# EAGLE design meter (EAGLE 6.5.0)
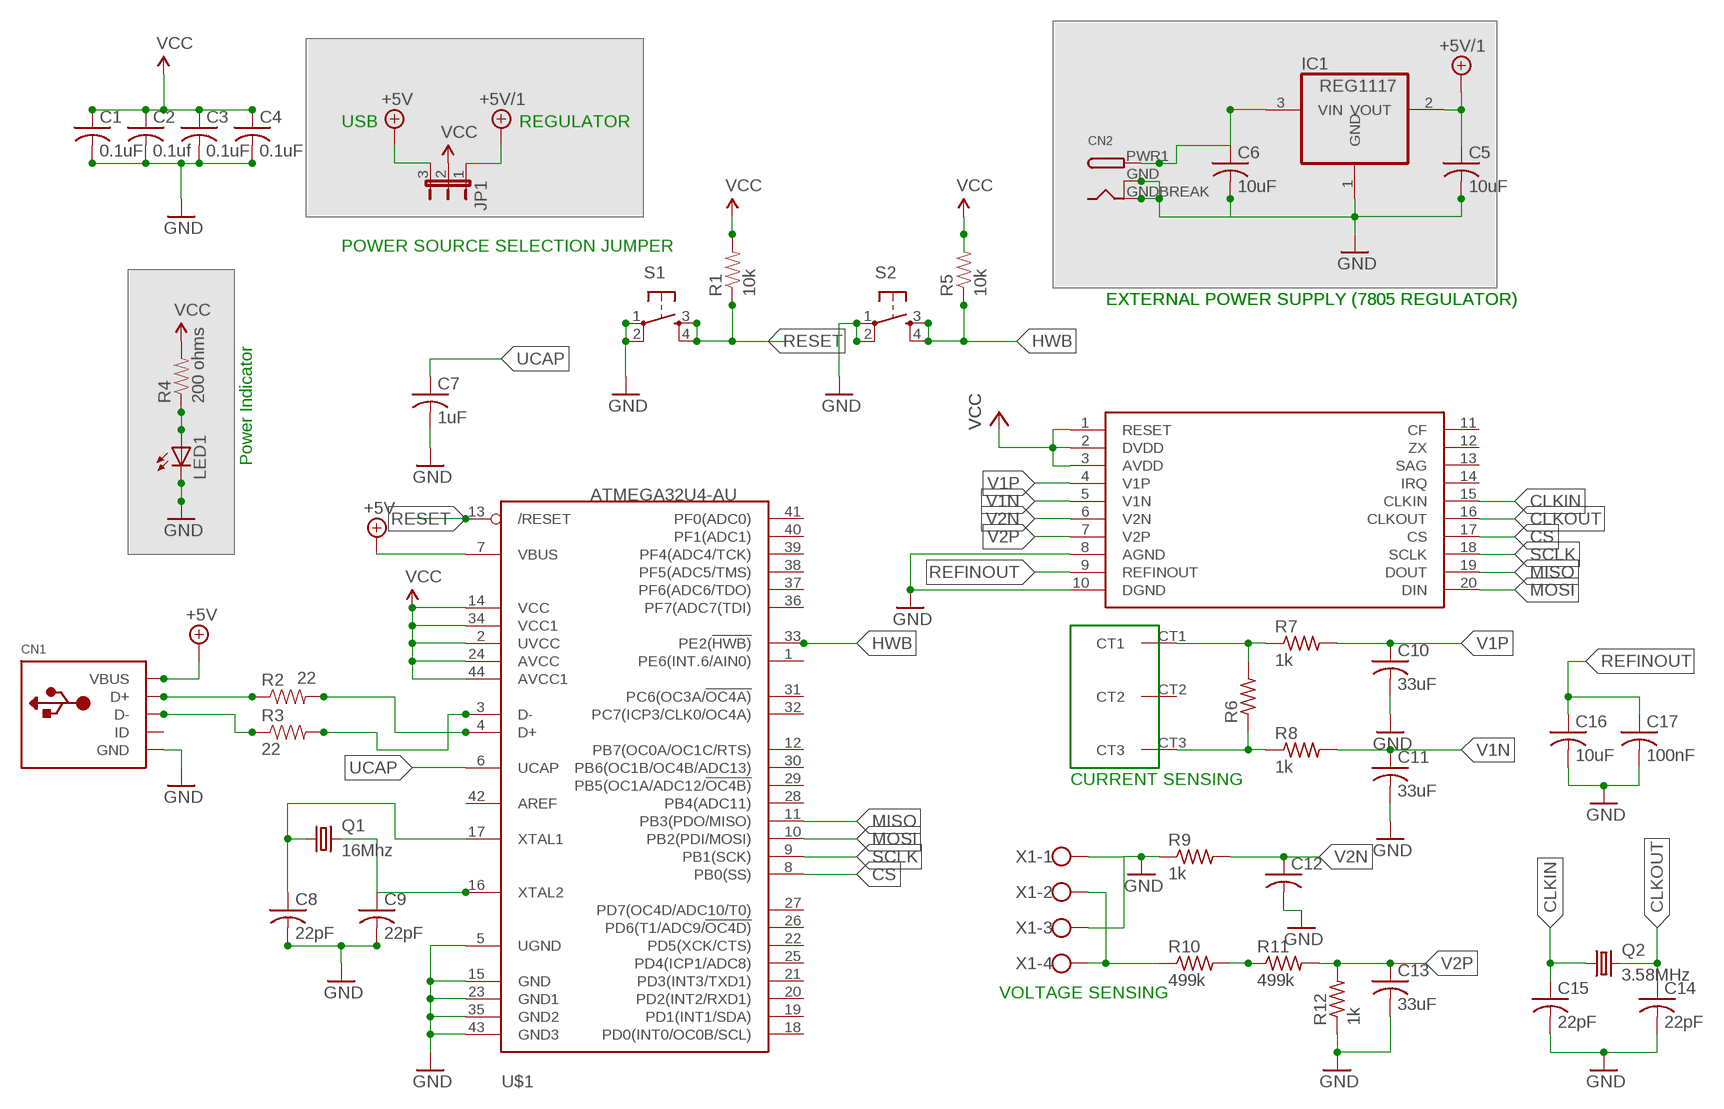
[diagram p0: schematic, sheet 1]

## Parts
C1  0.1uF  C-USC0603  [C0603]
C2  0.1uf  C-USC0603  [C0603]
C3  0.1uF  C-USC0603  [C0603]
C4  0.1uF  C-USC0603  [C0603]
C5  10uF  C-USC0603  [C0603]
C6  10uF  C-USC0603  [C0603]
C7  1uF  C-USC0603  [C0603]
C8  22pF  C-USC0603  [C0603]
C9  22pF  C-USC0603  [C0603]
C10  33uF  C-USC0603  [C0603]
C11  33uF  C-USC0603  [C0603]
C12  C-USC0603  [C0603]
C13  33uF  C-USC0603  [C0603]
C14  22pF  C-USC0603  [C0603]
C15  22pF  C-USC0603  [C0603]
C16  10uF  C-USC0603  [C0603]
C17  100nF  C-USC0603  [C0603]
CN1  USBMINIB  [USB-MINIB]
CN2  DCBARRELSMT  [DCJACK_2MM_SMT]
IC1  REG1117  [SOT223]
JP1  JP2E  [JP2]
LED1  LEDCHIP-LED0805  [CHIP-LED0805]
Q1  16Mhz  CSM-7X-DU  [CSM-7X-DU]
Q2  3.58MHz  CSM-7X-DU  [CSM-7X-DU]
R1  10k  RESISTOR0603-RES  [0603-RES]
R2  22  RESISTOR0603-RES  [0603-RES]
R3  22  RESISTOR0603-RES  [0603-RES]
R4  200 ohms  RESISTOR0603-RES  [0603-RES]
R5  10k  RESISTOR0603-RES  [0603-RES]
R6  R-US_R0603  [R0603]
R7  1k  R-US_R0603  [R0603]
R8  1k  R-US_R0603  [R0603]
R9  1k  R-US_R0603  [R0603]
R10  499k  R-US_R0603  [R0603]
R11  499k  R-US_R0603  [R0603]
R12  1k  R-US_R0603  [R0603]
S1  TAC_SWITCHSMD  [TACTILE_SWITCH_SMD]
S2  TAC_SWITCHSMD  [TACTILE_SWITCH_SMD]
U$1  ATMEGA32U4-AU  [TQFP44]
U$2  ADE7753  [SSOP20]
U$3  CT  [CT1075]
X1  W239-104  [W239-104]

## Nets
+5V: CN1.VBUS JP1.3 U$1.7(VBUS)
+5V/1: C5.1 IC1.2(VOUT) JP1.1
CLKIN: C15.1 Q2.1 U$2.15(CLKIN)
CLKOUT: C14.1 Q2.2 U$2.16(CLKOUT)
CS: U$1.8(PB0(SS)) U$2.17(CS)
GND: C1.2 C2.2 C3.2 C4.2 C5.2 C6.2 C7.2 C8.2 C9.2 C10.2 C11.2 C12.2 C13.2 C14.2 C15.2 C16.2 C17.2 CN1.GND CN2.GND(GNDBREAK) CN2.GNDBREAK(GND) IC1.1(GND) LED1.C R9.1 R12.1 S1.1 S1.2 S2.1 S2.2 U$1.5(UGND) U$1.15(GND) U$1.23(GND1) U$1.35(GND2) U$1.43(GND3) U$2.8(AGND) U$2.10(DGND) X1.1 X1.3
HWB: R5.1 S2.3 S2.4 U$1.33(PE2(!HWB))
MISO: U$1.11(PB3(PDO/MISO)) U$2.19(DOUT)
MOSI: U$1.10(PB2(PDI/MOSI)) U$2.20(DIN)
N$1: C8.1 Q1.1 U$1.17(XTAL1)
N$2: R10.2 R11.1
N$3: CN1.D+ R2.1
N$4: R2.2 U$1.4(D+)
N$5: CN1.D- R3.1
N$6: R3.2 U$1.3(D-)
N$7: LED1.A R4.1
N$8: C6.1 CN2.PWR1(PWR) IC1.3(VIN)
N$13: R6.2 R7.1 U$3.CT1
N$14: R6.1 R8.1 U$3.CT3
N$15: R10.1 X1.2 X1.4
N$17: C9.1 Q1.2 U$1.16(XTAL2)
REFINOUT: C16.1 C17.1 U$2.9(REFINOUT)
RESET: R1.1 S1.3 S1.4 U$1.13(/RESET)
SCLK: U$1.9(PB1(SCK)) U$2.18(SCLK)
UCAP: C7.1 U$1.6(UCAP)
V1N: C11.1 R8.2 U$2.5(V1N)
V1P: C10.1 R7.2 U$2.4(V1P)
V2N: C12.1 R9.2 U$2.6(V2N)
V2P: C13.1 R11.2 R12.2 U$2.7(V2P)
VCC: C1.1 C2.1 C3.1 C4.1 JP1.2 R1.2 R4.2 R5.2 U$1.2(UVCC) U$1.14(VCC) U$1.24(AVCC) U$1.34(VCC1) U$1.44(AVCC1) U$2.1(RESET) U$2.2(DVDD) U$2.3(AVDD)
Unconnected: CN1.ID U$1.1(PE6(INT.6/AIN0)) U$1.12(PB7(OC0A/OC1C/RTS)) U$1.18(PD0(INT0/OC0B/SCL)) U$1.19(PD1(INT1/SDA)) U$1.20(PD2(INT2/RXD1)) U$1.21(PD3(INT3/TXD1)) U$1.22(PD5(XCK/CTS)) U$1.25(PD4(ICP1/ADC8)) U$1.26(PD6(T1/ADC9/!OC4D)) U$1.27(PD7(OC4D/ADC10/T0)) U$1.28(PB4(ADC11)) U$1.29(PB5(OC1A/ADC12/!OC4B)) U$1.30(PB6(OC1B/OC4B/ADC13)) U$1.31(PC6(OC3A/!OC4A)) U$1.32(PC7(ICP3/CLK0/OC4A)) U$1.36(PF7(ADC7(TDI)) U$1.37(PF6(ADC6/TDO)) U$1.38(PF5(ADC5/TMS)) U$1.39(PF4(ADC4/TCK)) U$1.40(PF1(ADC1)) U$1.41(PF0(ADC0)) U$1.42(AREF) U$2.11(CF) U$2.12(ZX) U$2.13(SAG) U$2.14(IRQ) U$3.CT2

## Notes on the sheet
- USB | REGULATOR
- POWER SOURCE SELECTION JUMPER
- EXTERNAL POWER SUPPLY (7805 REGULATOR) | EXTERNAL POWER SUPPLY (7805 REGULATOR)
- Power Indicator
- CURRENT SENSING
- VOLTAGE SENSING

## Library data of the parts
C1-C17 = adafruit:C-US: CAPACITOR, American symbol
CN1 = adafruit:USB: USB Connectors USBMINIB - Surface Mount Female Mini-B USB Connector 4UConnector: 06564 By microbuilder.eu Thru-hole RA Female Mini-B USB Connector 4UConnector: 18732 By ladyada.net
CN2 = adafruit:DCBARREL: 2.0mm DC Barrel Jack DCJACK_2MM_PTH - Through Hole Jack (4UConnector: 05537)
IC1 = burr-brown:REG1117: 800mA and 1A Low Dropout (LDO) Positive Regulator 1.8V, 2.5V, 2.85V, 3.3V, 5V, and Adj; MPN: REG1117; OC_FARNELL: 1097566; OC_NEWARK: 14P6981
JP1 = jumper:JP2E: JUMPER
LED1 = adafruit:LED: LED OSRAM: - CHIPLED LG R971, LG N971, LY N971, LG Q971, LY Q971, LO R971, LY R971 LH N974, LH R974 LS Q976, LO Q976, LY Q976 LO Q996 - Hyper CHIPLED LW Q18S LB Q993, LB Q99A, LB R99A - SideLED LS A670, LO A670, LY A670, LG A670, LP A670 LB A673, LV A673, LT A673, LW A673 LH A674 LY A675 LS A676, LA A676, LO A676, LY A676, LW A676 LS A679, LY A679, LG A679 - Hyper Micro SIDELED® LS Y876, LA Y876, LO Y876, LY Y876 LT Y87S - SmartLED LW L88C, LW L88S LB L89C, LB L89S, LG L890 LS L89K, LO L89K, LY L89K LS L896, LA L896, LO L896, LY L896 - TOPLED LS T670, LO T670, LY T670, LG T670, LP T670 LSG T670, LSP T670, LSY T670, LOP T670, LYG T670 LG T671, LOG T671, LSG T671 LB T673, LV T673, LT T673, LW T673 LH T674 LS T676, LA T676, LO T676, LY T676, LB T676, LH T676, LSB T676, LW T676 LB T67C, LV T67C, LT T67C, LS T67K, LO T67K, LY T67K, LW E67C LS E67B, LA E67B, LO E67B, LY E67B, LB E67C, LV E67C, LT E67C LW T67C LS T679, LY T679, LG T679 LS T770, LO T770, LY T770, LG T770, LP T770 LB T773, LV T773, LT T773, LW T773 LH T774 LS E675, LA E675, LY E675, LS T675 LS T776, LA T776, LO T776, LY T776, LB T776 LHGB T686 LT T68C, LB T68C - Hyper Mini TOPLED® LB M676 - Mini TOPLED Santana® LG M470 LS M47K, LO M47K, LY M47K Source: http://www.osram.convergy.de/
Q1 Q2 = crystal:CSM-7X-DU: SMD CRYSTAL Source: www.ecsxtal.com .. Crystal 3.6864MHz CSM_7X_DU.PDF; OC_FARNELL: unknown; OC_NEWARK: unknown
R1-R5 = SparkFun-Passives:RESISTOR: Resistor Basic schematic elements and footprints for 0603, 1206, and PTH resistors.
R6-R12 = adafruit:R-US_: RESISTOR, American symbol
S1 S2 = SparkFun-Electromechanical:TAC_SWITCH: Momentary Switch Button commonly used for reset or general input. Spark Fun Electronics SKU : COM-00097 SMT- SWCH-08247; PROD_ID: SWCH-08247
U$1 = adafruit:ATMEGA32U4: http://www.ladyada.net/library/eagle
U$2 = ade7735:ADE7753
U$3 = ct1075:CT
X1 = con-wago-500:W239-104: WAGO SCREW CLAMP; OC_FARNELL: unknown; OC_NEWARK: unknown

## Net classes
0 default: clearance 0.381 mm

## Board
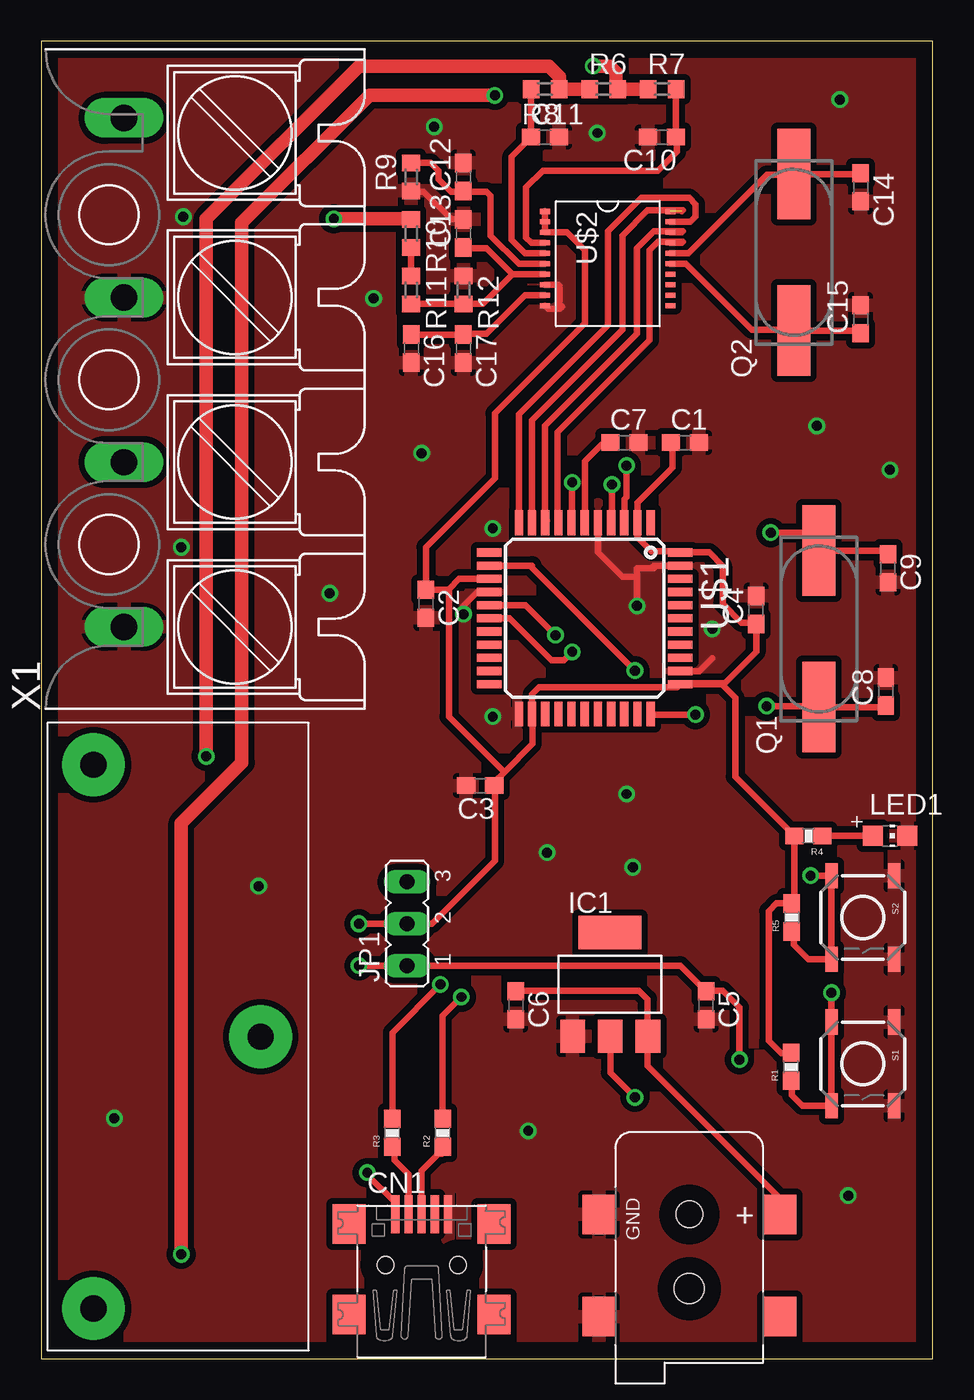
[diagram p1: board, top side]
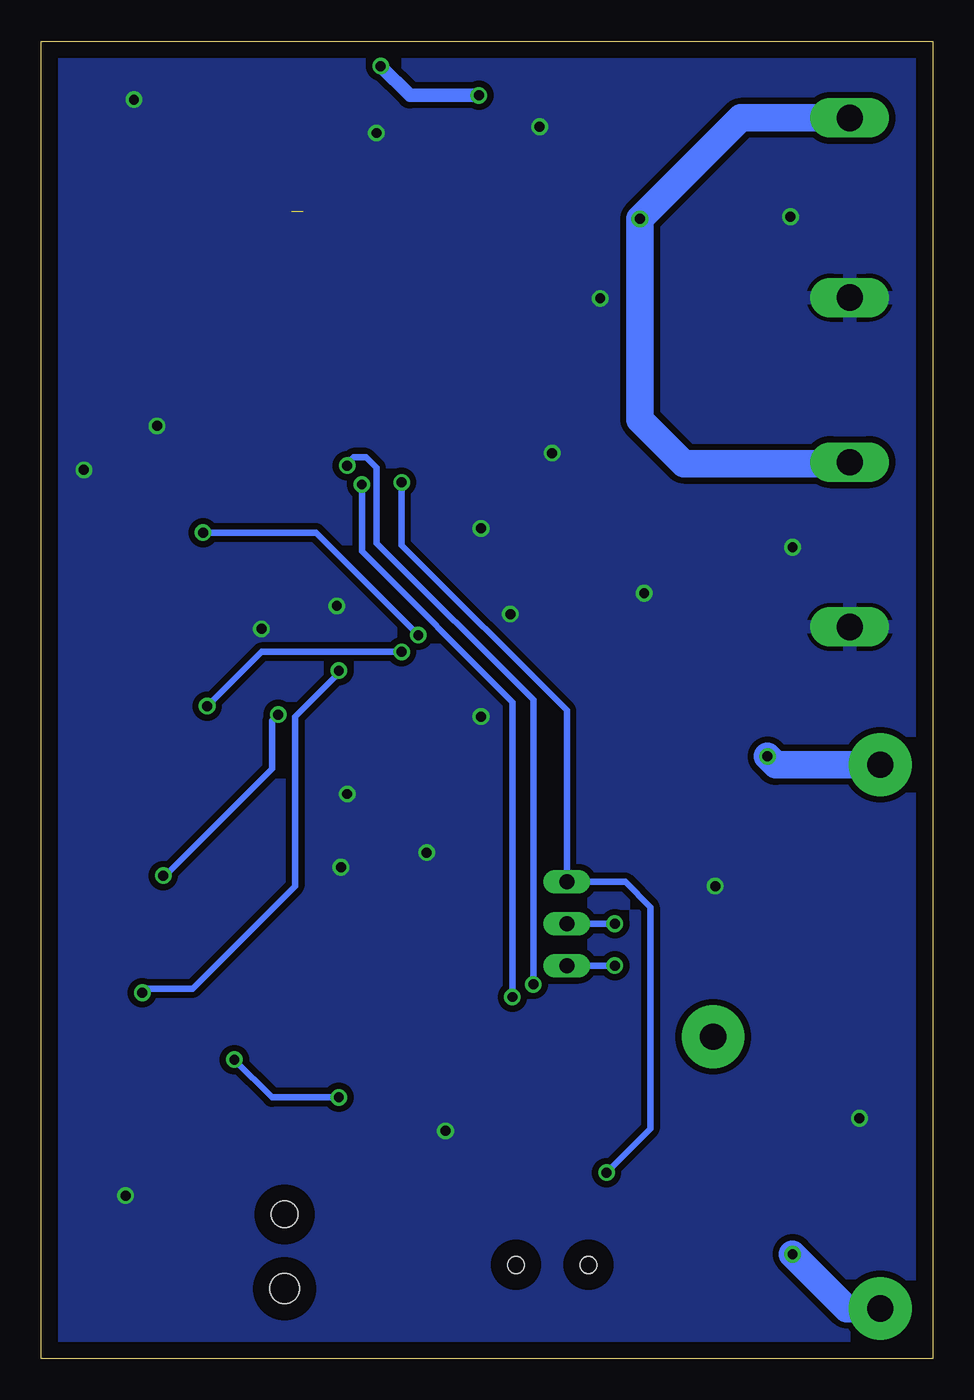
[diagram p2: board, bottom side, seen from below]

Size 54.15 x 80 mm. Coordinates in mm from the lower left corner, seen from the top.
Outline: 0,0 54.15,0 54.15,80 0,80 0,0
Copper layers (1*16): Top 0.035mm / dielectric 1.5mm / Bottom 0.035mm
Design rules "default": minimum track width 10mil, minimum drill 24mil, track to track 8mil, track to pad 8mil, pad to pad 8mil, via to via 8mil, smd to smd 8mil, copper to edge 40mil, drill to drill 8mil, minimum pad ring 10mil, minimum via ring 8mil, stop-mask expansion 4mil, vias tented up to drill 0mil, thermal gap 10mil

### Footprints (pad centres in the part's own frame; a part is rotated, then mirrored left to right if it is on the bottom)
C0603 = smd 1.1 x 1: 1 -0.85,0; 2 0.85,0
USB-MINIB = smd 0.5 x 2.308: D+ 0,4.064; D- -0.8,4.064; GND 1.6,4.064; ID 0.8,4.064; VBUS -1.6,4.064 | smd 2 x 2.4: GND1 -4.4,-2; GND2 -4.4,3.5; GND3 4.4,3.5; GND4 4.4,-2 | hole 1: -2.2,1; 2.2,1
DCJACK_2MM_SMT = smd 2.4 x 2: GND 0,-5.5; GNDBREAK 6.2,-5.5; PWR1 0,5.5; PWR2 6.2,5.5 | hole 1.6: 0,0 | hole 1.8: 4.5,0
SOT223 = smd 1.499 x 2.007: 1 -2.261,-3.15; 2 0.025,-3.15; 3 2.311,-3.15 | smd 3.81 x 2.007: 4 0,3.15
JP2 = drill 0.914 long: 1 -2.54,0; 2 0,0; 3 2.54,0
CHIP-LED0805 = smd 1.2 x 1.2: A 0,-1.05; C 0,1.05
CSM-7X-DU = smd 5.5 x 2: 1 -4.75,0; 2 4.75,0
0603-RES = smd 1.1 x 1: 1 -0.85,0; 2 0.85,0
R0603 = smd 1 x 1.1: 1 -0.85,0; 2 0.85,0
TACTILE_SWITCH_SMD = smd 1.524 x 0.762: 1 -2.54,1.905; 2 2.54,1.905; 3 -2.54,-1.905; 4 2.54,-1.905
TQFP44 = smd 1.5 x 0.5: 1 -5.8,4; 2 -5.8,3.2; 3 -5.8,2.4; 4 -5.8,1.6; 5 -5.8,0.8; 6 -5.8,0; 7 -5.8,-0.8; 8 -5.8,-1.6; 9 -5.8,-2.4; 10 -5.8,-3.2; 11 -5.8,-4; 23 5.8,-4; 24 5.8,-3.2; 25 5.8,-2.4; 26 5.8,-1.6; 27 5.8,-0.8; 28 5.8,0; 29 5.8,0.8; 30 5.8,1.6; 31 5.8,2.4; 32 5.8,3.2; 33 5.8,4 | smd 0.5 x 1.5: 12 -4,-5.8; 13 -3.2,-5.8; 14 -2.4,-5.8; 15 -1.6,-5.8; 16 -0.8,-5.8; 17 0,-5.8; 18 0.8,-5.8; 19 1.6,-5.8; 20 2.4,-5.8; 21 3.2,-5.8; 22 4,-5.8; 34 4,5.8; 35 3.2,5.8; 36 2.4,5.8; 37 1.6,5.8; 38 0.8,5.8; 39 0,5.8; 40 -0.8,5.8; 41 -1.6,5.8; 42 -2.4,5.8; 43 -3.2,5.8; 44 -4,5.8
SSOP20 = smd 0.305 x 0.61: 1 -3.493,-3.81; 2 -2.857,-3.81; 3 -2.223,-3.81; 4 -1.587,-3.81; 5 -0.953,-3.81; 6 -0.318,-3.81; 7 0.318,-3.81; 8 0.953,-3.81; 9 1.587,-3.81; 10 2.223,-3.81; 11 2.223,3.81; 12 1.587,3.81; 13 0.953,3.81; 14 0.318,3.81; 15 -0.318,3.81; 16 -0.953,3.81; 17 -1.587,3.81; 18 -2.223,3.81; 19 -2.857,3.81; 20 -3.493,3.81
CT1075 = drill 1.6 pad 3.81: CT1 -16.51,10.16; CT2 0,0; CT3 16.51,10.16
W239-104 = drill 1.6 long: 1 -15,5; 2 -5,5; 3 5,5; 4 15.9,5

### Placement (x,y rotation side)
C1  39.12,55.63 0 top
C2  23.37,45.85 270 top
C3  26.67,34.8 180 top
C4  43.43,45.47 90 top
C5  40.39,21.46 270 top
C6  28.83,21.46 270 top
C7  35.43,55.63 0 top
C8  51.31,40.51 90 top
C9  51.44,48.01 270 top
C10  37.72,74.17 180 top
C11  30.61,74.17 0 top
C12  25.65,71.75 90 top
C13  25.65,68.33 90 top
C14  49.78,71.12 270 top
C15  49.78,63.12 90 top
C16  22.48,61.34 270 top
C17  25.65,61.34 270 top
CN1  23.11,4.7 0 top
CN2  39.37,8.76 270 top
IC1  34.54,22.73 0 top
JP1  22.23,26.42 90 top
LED1  51.56,31.75 270 top
Q1  47.24,44.32 90 top
Q2  45.72,67.18 90 top
R1  45.54,17.73 90 top
R2  24.38,13.72 90 top
R3  21.34,13.72 90 top
R4  46.61,31.75 180 top
R5  45.59,26.8 90 top
R6  34.16,77.09 0 top
R7  37.72,77.09 0 top
R8  30.61,77.09 180 top
R9  22.48,71.75 90 top
R10  22.48,68.33 270 top
R11  22.48,64.9 270 top
R12  25.65,64.9 270 top
S1  49.91,17.91 270 top
S2  49.91,26.8 270 top
U$1  33.02,44.96 270 top
U$2  34.42,66.17 270 top
U$3  13.34,19.56 90 top
X1  10.03,59.44 90 top

### Tracks (layer width: path | path; a pad name or v marks a point on that pad's centre or on a via)
+5V  (via drill 0.6)
  Top 0.406: v19.81,11.3 19.81,11.18 21.46,9.53 21.46,8.81 CN1.VBUS | v32.26,53.21 32.26,50.8 U$1.7
  Bottom 0.406: v19.81,11.3 17.14,13.97 17.14,27.43 18.67,28.96 JP1.3 22.23,39.37 32.26,49.4 v32.26,53.21
+5V/1  (via drill 0.6)
  Top 0.406: IC1.2 34.57,17.37 v36.07,15.88 | v42.42,18.16 42.42,21.34 41.4,22.35 40.42,22.35 C5.1 38.82,23.88 v19.3,23.88
  Bottom 0.406: v36.07,15.88 40.13,15.88 v42.42,18.16 | JP1.1 v19.3,23.88
CLKIN
  Top 0.406: U$2.15 39.18,66.48 43.18,62.48 45.67,62.48 Q2.1 49.62,62.43 C15.1
CLKOUT
  Top 0.406: C14.1 49.75,71.93 Q2.2 45.67,71.88 44.07,71.88 39.31,67.12 U$2.16
CS
  Top 0.406: U$2.17 38.92,67.75 38.99,67.82 37.47,67.82 36.96,67.31 36.96,61.85 31.37,56.26 31.37,50.81 U$1.8 31.5,50.83
GND  (via drill 0.6)
  Top 0.406: U$1.43 37.21,48.16 37.21,48.01 36.2,48.01 36.2,47.37 | 36.2,47.37 v36.2,45.72 | U$1.35 39.98,41.76 40.77,42.55 | U$1.5 33.82,48.98 35.31,47.5 36.07,47.5 36.2,47.37 | v25.65,45.21 25.65,45.72 26.54,46.61 27.17,46.61 U$1.15 | C13.2 24.93,69.18 23.24,70.87 22.52,70.87 R9.1 | U$2.8 31.43,65.22 31.5,65.15 31.5,64.01 31.62,63.88 31.5,63.75 30.8,63.75 U$2.10
  other vias: 4.45,14.61 13.21,28.7 29.59,13.84 30.73,30.73 35.56,34.29 35.94,29.84 49.02,9.91 51.56,53.98 47.12,56.64 17.53,46.48 8.51,49.28 23.11,54.99 20.19,64.39 8.64,69.34 23.88,74.8 48.51,76.45 27.43,50.42 40.77,44.32 33.78,74.42 27.43,38.99
  pour Top: -0.38,80.39 -0.51,80.39 -0.51,-0.51 54.99,-0.51 54.99,80.39
  pour Bottom: -0.38,80.52 -0.38,-0.76 54.99,-0.76 54.99,80.52
HWB  (via drill 0.6)
  Top 0.406: R5.1 45.72,25.82 45.72,25.15 46.61,24.26 S2.4 S2.3 v46.74,29.34 | v39.75,39.12 37.06,39.12 U$1.33
  Bottom 0.406: v46.74,29.34 46.61,29.34 40.13,35.81 40.13,38.73 v39.75,39.12
MISO
  Top 0.406: U$1.11 29.02,57.34 34.42,62.74 34.42,68.45 36.45,70.48 39.37,70.48 39.75,70.1 39.75,69.34 39.43,69.03 U$2.19
MOSI  (1 unrouted)
  Top 0.406: U$1.10 29.82,57 35.31,62.48 35.31,68.2 36.83,69.72 38.99,69.72 38.92,69.66
N$1  (via drill 0.6)
  Top 0.406: C8.1 51.22,39.57 Q1.1 47.19,39.62 v44.07,39.62 | v32.26,42.93 31.75,42.42 30.99,42.42 28.45,44.96 U$1.17 27.18,44.96
  Bottom 0.406: v32.26,42.93 40.77,42.93 v44.07,39.62
N$2
  Top 0.406: R10.2 R11.1
N$3
  Top 0.406: CN1.D+ 23.11,11.43 24.13,12.45 24.34,12.45 R2.1
N$4  (via drill 0.6)
  Top 0.406: R2.2 24.38,20.83 v25.53,21.97 | v34.67,53.09 34.67,50.81 U$1.4
  Bottom 0.406: v25.53,21.97 25.53,39.88 34.67,49.02 v34.67,53.09
N$5
  Top 0.406: CN1.D- 22.31,11.21 21.46,12.06 21.46,12.61 R3.1
N$6  (via drill 0.6)
  Top 0.406: R3.2 21.34,19.81 v24.26,22.73 | v35.56,54.23 35.56,52.32 35.43,52.2 35.43,50.77 U$1.3
  Bottom 0.406: v24.26,22.73 24.26,40.01 33.78,49.53 33.78,54.1 34.42,54.74 35.18,54.74 35.56,54.36 v35.56,54.23
N$7
  Top 0.406: LED1.A R4.1
N$8
  Top 0.406: CN2.PWR1 44.87,9.74 36.83,17.78 36.83,19.56 | 36.83,19.56 IC1.3 | 36.83,19.56 36.83,21.84 36.32,22.35 28.87,22.35 C6.1
N$13  (via drill 0.6)
  Top 0.406: 34.92,77.18 R6.2
  Top 0.813: R6.2 R7.1 | v8.51,6.35 8.51,32.51 12.19,36.2 12.19,68.96 19.94,76.71 v27.56,76.71 | v33.53,78.49 34.54,78.49 34.92,78.11 34.92,77.18
  Bottom 0.813: v27.56,76.71 31.75,76.71 v33.53,78.49
  Bottom 1.676: U$3.CT1 5.21,3.05 v8.51,6.35
N$14  (via drill 0.6)
  Top 0.406: 31.5,77.13 R8.1
  Top 0.813: R6.1 R8.1 | v10.03,36.58 10.03,69.22 19.3,78.49 30.86,78.49 31.5,77.85 31.5,77.13
  Bottom 1.676: U$3.CT3 9.53,36.07 v10.03,36.58
N$15  (via drill 0.6)
  Top 0.61: 22.44,69.22 R10.1
  Top 0.813: v17.78,69.22 22.44,69.22
  Bottom 1.676: X1.4 11.66,75.34 v17.78,69.22 17.78,57.02 15.11,54.36 5.11,54.36 X1.2
N$17  (via drill 0.6)
  Top 0.406: v31.24,43.94 29.43,45.76 U$1.16 27.14,45.76 | v44.32,50.16 47.12,50.16 47.5,49.78 47.5,49.33 Q1.2 51.22,49.07 C9.1
  Bottom 0.406: v31.24,43.94 37.47,50.16 v44.32,50.16
REFINOUT
  Top 0.406: U$2.9 29.4,64.58 27.05,62.23 25.69,62.23 C17.1 C16.1
RESET  (via drill 0.6)
  Top 0.406: R1.1 45.59,16.83 45.59,16 46.23,15.37 S1.4 S1.3 v48.01,22.23 | U$1.13 29.82,48.16 29.82,48.03 v36.07,41.78
  Bottom 0.406: v48.01,22.23 47.75,22.48 44.96,22.48 38.73,28.7 38.73,38.99 36.07,41.66 v36.07,41.78
SCLK
  Top 0.406: U$2.18 38.92,68.39 38.99,68.45 37.21,68.45 36.2,67.44 36.2,62.23 30.61,56.64 30.61,50.77 U$1.9 30.73,50.87
UCAP
  Top 0.406: U$1.6 33.02,54.48 34.04,55.5 34.46,55.5 C7.1
V1N
  Top 0.406: U$2.5 29.4,67.12 28.57,67.94 28.57,72.99 C11.1 R8.2
V1P
  Top 0.406: U$2.4 29.78,67.75 29.46,68.07 29.46,71.12 30.48,72.14 37.47,72.14 38.61,73.28 38.61,74.13 C10.1 R7.2
V2N
  Top 0.406: R9.2 23.66,72.61 24.13,72.14 24.13,71.63 24.89,70.87 25.61,70.87 C12.1 25.69,70.87 27.05,70.87 27.3,70.61 27.3,68.2 29.02,66.48 U$2.6
V2P
  Top 0.406: R11.2 R12.2 26.84,64.05 28.64,65.85 | U$2.7 28.64,65.85 | 28.64,65.85 27.05,67.44 25.69,67.44 C13.1
VCC  (via drill 0.6)
  Top 0.406: U$2.1 U$2.2 U$2.3 31.94,68.39 33.02,67.31 33.02,62.87 27.56,57.4 27.56,53.47 23.37,49.28 C2.1 24.73,46.7 24.77,46.74 | 25.39,47.36 25.4,47.37 27.21,47.37 U$1.14 25.39,47.36 | R1.2 45.51,18.54 44.96,18.54 44.2,19.3 44.2,27.18 44.66,27.65 R5.2 45.76,27.81 R4.2 42.16,35.34 42.16,40.13 41.34,40.96 U$1.34 | C1.1 38.35,55.54 38.35,54.1 36.22,51.97 U$1.2 36.22,49.89 37.08,49.02 38.76,49.02 U$1.44 40.58,48.96 41.4,48.13 41.4,45.85 42.55,44.7 43.35,44.7 C4.1 43.43,42.93 41.53,41.02 38.88,41.02 U$1.34 | v19.3,26.42 23.75,26.42 27.56,30.23 27.56,34.76 C3.1 27.52,35.01 28.13,35.62 | 28.13,35.62 29.84,37.34 29.84,39.13 U$1.24 29.82,40.36 30.23,40.77 38.63,40.77 U$1.34 | 25.39,47.36 24.77,46.74 | 24.77,46.74 24.77,38.99 28.13,35.62
  Bottom 0.406: JP1.2 v19.3,26.42